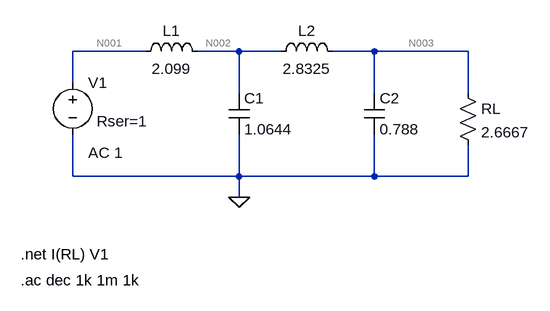
[diagram p0: schematic Normalizado.asc]
Normalizado.asc, the LTspice schematic file:
Version 4
SHEET 1 880 680
WIRE 16 128 -96 128
WIRE 160 128 96 128
WIRE 224 128 160 128
WIRE 368 128 304 128
WIRE 512 128 368 128
WIRE -96 176 -96 128
WIRE 160 192 160 128
WIRE 368 192 368 128
WIRE 512 192 512 128
WIRE -96 320 -96 256
WIRE 160 320 160 256
WIRE 160 320 -96 320
WIRE 368 320 368 256
WIRE 368 320 160 320
WIRE 512 320 512 272
WIRE 512 320 368 320
WIRE 160 352 160 320
FLAG 160 352 0
SYMBOL ind 0 144 R270
WINDOW 0 32 56 VTop 2
WINDOW 3 5 56 VBottom 2
SYMATTR InstName L1
SYMATTR Value 2.099
SYMBOL cap 144 192 R0
SYMATTR InstName C1
SYMATTR Value 1.0644
SYMBOL ind 208 144 R270
WINDOW 0 32 56 VTop 2
WINDOW 3 5 56 VBottom 2
SYMATTR InstName L2
SYMATTR Value 2.8325
SYMBOL cap 352 192 R0
SYMATTR InstName C2
SYMATTR Value 0.788
SYMBOL res 496 176 R0
SYMATTR InstName RL
SYMATTR Value 2.6667
SYMBOL voltage -96 160 R0
WINDOW 123 24 124 Left 2
WINDOW 39 37 75 Left 2
SYMATTR Value2 AC 1
SYMATTR SpiceLine Rser=1
SYMATTR InstName V1
SYMATTR Value ""
TEXT -176 440 Left 2 !.net I(RL) V1
TEXT -176 480 Left 2 !.ac dec 1k 1m 1k

The netlist it stands for:
* Normalizado.asc
L1 N001 N002 2.099
C1 N002 0 1.0644
L2 N002 N003 2.8325
C2 N003 0 0.788
RL N003 0 2.6667
V1 N001 0 AC 1 Rser=1
.net I(RL) V1
.ac dec 1k 1m 1k
.backanno
.end

* Results of the author's LTspice run, read from the files saved beside the schematic
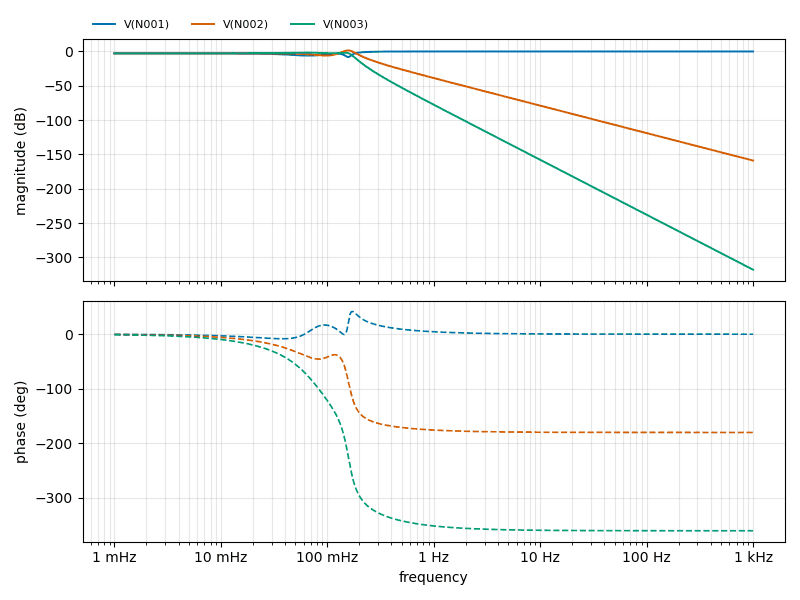
[diagram p1: AC Analysis of Normalizado.asc, plotted from the saved traces]
* AC Analysis, 1 run:
*   V(N001): -2.77 dB at 1 mHz, -0.00 dB at 1 kHz, peak -0.00 dB at 1 kHz, 3 dB below the peak at 180.6 mHz
*   V(N002): -2.77 dB at 1 mHz, -158.91 dB at 1 kHz, peak 1.51 dB at 156.7 mHz, 3 dB below the peak at 134.8 mHz and 178.8 mHz
*   V(N003): -2.77 dB at 1 mHz, -317.81 dB at 1 kHz, peak -1.77 dB at 60.95 mHz, 3 dB below the peak at 167.6 mHz